# EAGLE schematic air_flow (EAGLE 9.5.2)
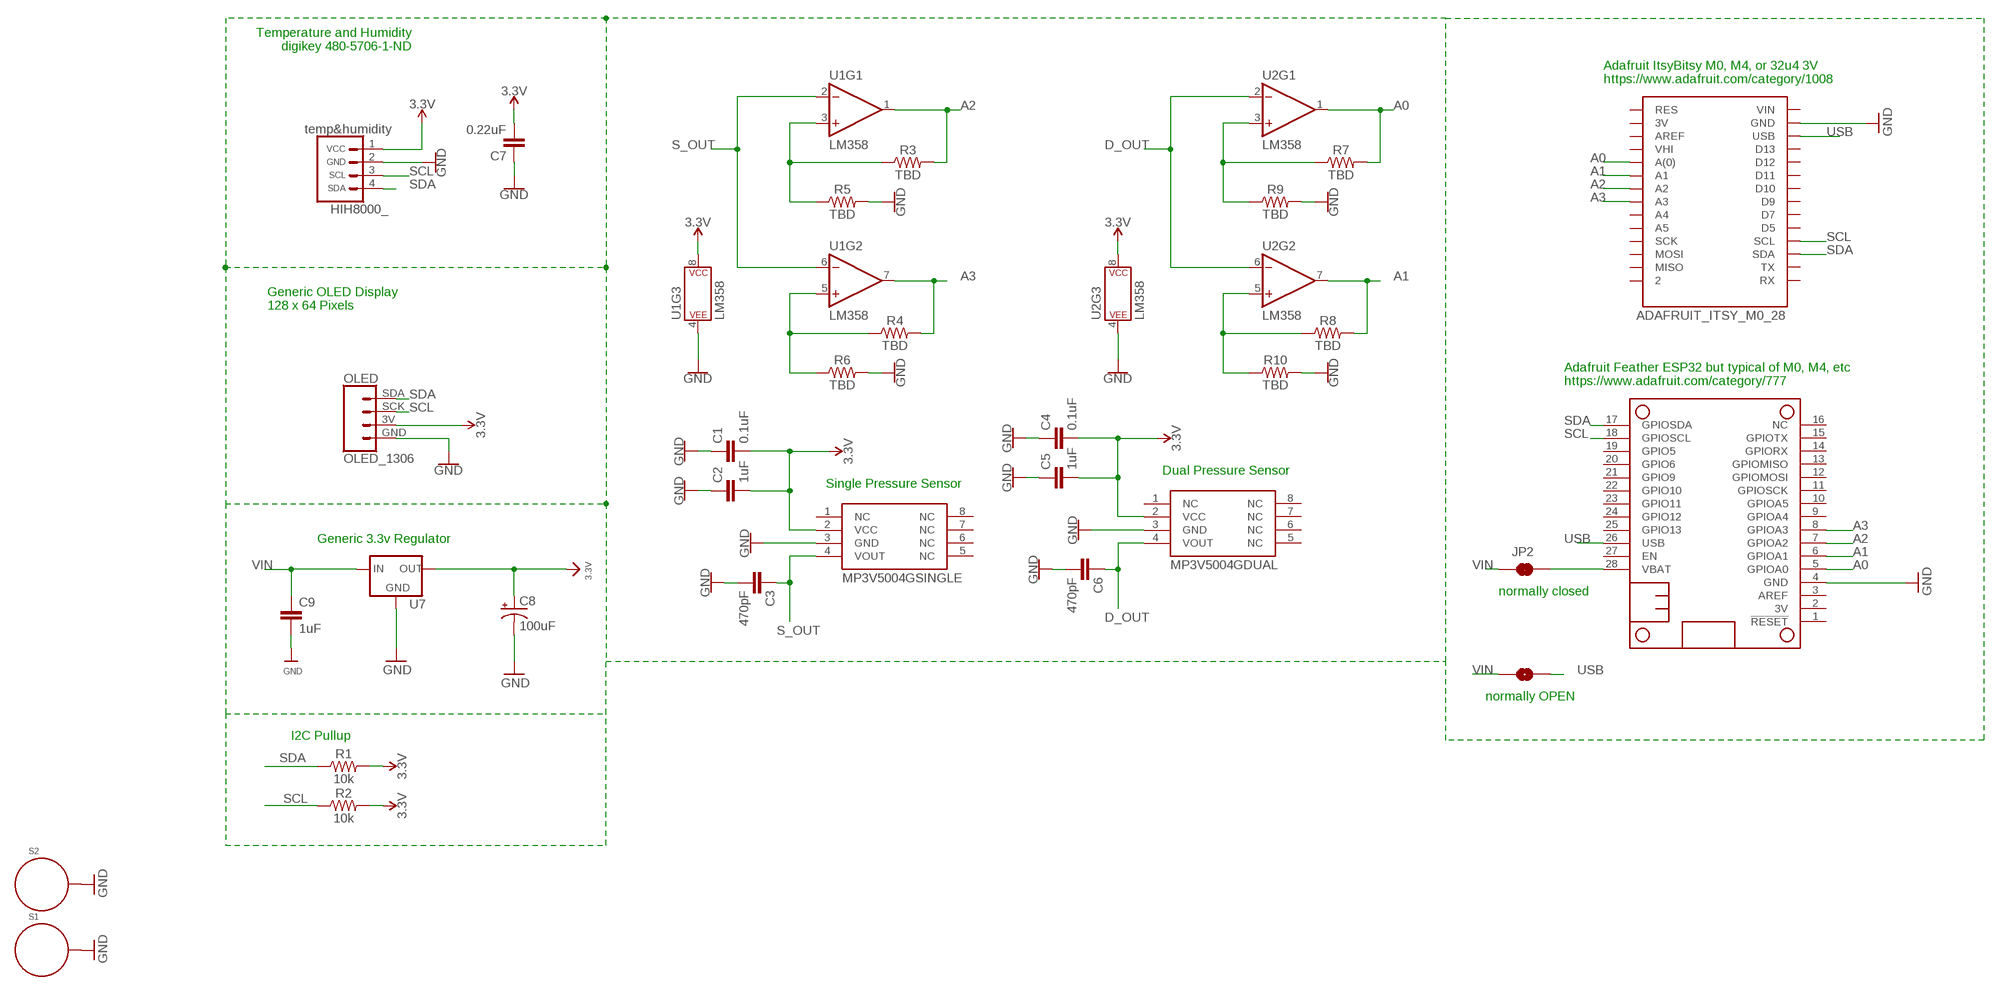
[diagram p0: schematic, sheet 1]

## Parts
C1  0.1uF  0.1UF-KIT-EZ-50V-20%  [CAP-PTH-SMALL-KIT]
C2  1uF  0.1UF-KIT-EZ-50V-20%  [CAP-PTH-SMALL-KIT]
C3  470pF  0.1UF-KIT-EZ-50V-20%  [CAP-PTH-SMALL-KIT]
C4  0.1uF  0.1UF-KIT-EZ-50V-20%  [CAP-PTH-SMALL-KIT]
C5  1uF  0.1UF-KIT-EZ-50V-20%  [CAP-PTH-SMALL-KIT]
C6  470pF  0.1UF-KIT-EZ-50V-20%  [CAP-PTH-SMALL-KIT]
C7  0.22uF  0.1UF-KIT-EZ-50V-20%  [CAP-PTH-SMALL-KIT]
C8  100uF  CPOL-USE3.5-8  [E3,5-8]
C9  1uF  0.1UF-KIT-EZ-50V-20%  [CAP-PTH-SMALL-KIT]
JP1  JUMPER-SMT_2_NO_NO-SILK  [SMT-JUMPER_2_NO_NO-SILK]
JP2  JUMPER-SMT_2_NC_TRACE_SILK  [SMT-JUMPER_2_NC_TRACE_SILK]
MS2  FEATHERWING_NODIM  [FEATHERWING_DIM]
R1  10k  10KOHM-HORIZ-1/4W-5%  [AXIAL-0.3]
R2  10k  10KOHM-HORIZ-1/4W-5%  [AXIAL-0.3]
R3  TBD  10KOHM-HORIZ-1/4W-5%  [AXIAL-0.3]
R4  TBD  10KOHM-HORIZ-1/4W-5%  [AXIAL-0.3]
R5  TBD  10KOHM-HORIZ-1/4W-5%  [AXIAL-0.3]
R6  TBD  10KOHM-HORIZ-1/4W-5%  [AXIAL-0.3]
R7  TBD  10KOHM-HORIZ-1/4W-5%  [AXIAL-0.3]
R8  TBD  10KOHM-HORIZ-1/4W-5%  [AXIAL-0.3]
R9  TBD  10KOHM-HORIZ-1/4W-5%  [AXIAL-0.3]
R10  TBD  10KOHM-HORIZ-1/4W-5%  [AXIAL-0.3]
S1  STANDOFF_ELECTRICAL5-32  [STANDOFF_ELECTRICAL_5_32]
S2  STANDOFF_ELECTRICAL5-32  [STANDOFF_ELECTRICAL_5_32]
U1  LM358  [DIP08]
U2  LM358  [DIP08]
U7  V_REG_78XXSINK  [TO220-IGO]
U$1  OLED_1306  [OLED_1306]
U$2  MP3V5004GSINGLE  [MP3V5004GP]
U$3  MP3V5004GDUAL  [MP3V5004DP]
U$4  HIH8000_  [HIH8120_TH]
U$45  ADAFRUIT_ITSY_M0_28  [ADAFRUIT_ITS_MO_28]

## Nets
3.3V: C1.2 C2.2 C4.2 C5.2 C7.2 C8.+ R1.P$2 R2.P$2 U1.8(P$V+) U2.8(P$V+) U7.OUT U$1.3V(VCC) U$2.2(VCC) U$3.2(VCC) U$4.1(VCC)
A0: MS2.5(GPIOA0) R7.P$2 U2.1(OUT) U$45.A0(A(0))
A1: MS2.6(GPIOA1) R8.P$2 U2.7(OUT) U$45.A1
A2: MS2.7(GPIOA2) R3.P$2 U1.1(OUT) U$45.A2
A3: MS2.8(GPIOA3) R4.P$2 U1.7(OUT) U$45.A3
D_OUT: C6.1 U2.2(-IN) U2.6(-IN) U$3.4(VOUT)
GND: C1.1 C2.1 C3.2 C4.1 C5.1 C6.2 C7.1 C8.- C9.2 MS2.4(GND) R5.P$2 R6.P$2 R9.P$2 R10.P$2 S1.P1 S2.P1 U1.4(P$V-) U2.4(P$V-) U7.GND U$1.GND U$2.3(GND) U$3.3(GND) U$4.2(GND) U$45.GND
N$1: R3.P$1 R5.P$1 U1.3(+IN)
N$3: JP1.1
N$5: R4.P$1 R6.P$1 U1.5(+IN)
N$6: R7.P$1 R9.P$1 U2.3(+IN)
N$8: R8.P$1 R10.P$1 U2.5(+IN)
S_OUT: C3.1 U1.2(-IN) U1.6(-IN) U$2.4(VOUT)
SCL: MS2.18(GPIOSCL) R2.P$1 U$1.SCK U$4.3(SCL) U$45.SCL
SDA: MS2.17(GPIOSDA) R1.P$1 U$1.SDA U$4.4(SDA) U$45.SDA
USB: JP1.2 MS2.26(USB) U$45.USB
VBAT: JP2.2 MS2.28(VBAT)
VIN: C9.1 JP2.1 U7.IN
Unconnected: MS2.1(!RESET) MS2.2(3V) MS2.3(AREF) MS2.9(GPIOA4) MS2.10(GPIOA5) MS2.11(GPIOSCK) MS2.12(GPIOMOSI) MS2.13(GPIOMISO) MS2.14(GPIORX) MS2.15(GPIOTX) MS2.16(NC) MS2.19(GPIO5) MS2.20(GPIO6) MS2.21(GPIO9) MS2.22(GPIO10) MS2.23(GPIO11) MS2.24(GPIO12) MS2.25(GPIO13) MS2.27(EN) U$2.1(NC) U$2.5(NC) U$2.6(NC) U$2.7(NC) U$2.8(NC) U$3.1(NC) U$3.5(NC) U$3.6(NC) U$3.7(NC) U$3.8(NC) U$45.2 U$45.3V U$45.A4 U$45.A5 U$45.AREF U$45.D5 U$45.D7 U$45.D9 U$45.D10 U$45.D11 U$45.D12 U$45.D13 U$45.MISO U$45.MOSI U$45.RES U$45.RX U$45.SCK U$45.TX U$45.VHI U$45.VIN

## Notes on the sheet
- Temperature and Humidity
  digikey 480-5706-1-ND
- Adafruit ItsyBitsy M0, M4, or 32u4 3V
  https://www.adafruit.com/category/1008
- Generic OLED Display
  128 x 64 Pixels
- Adafruit Feather ESP32 but typical of M0, M4, etc
  https://www.adafruit.com/category/777
- Dual Pressure Sensor
- Single Pressure Sensor
- Generic 3.3v Regulator
- normally closed
- normally OPEN
- I2C Pullup

## Library data of the parts
C1 C4 = SparkFun-Capacitors:0.1UF: 0.1µF ceramic capacitors A capacitor is a passive two-terminal electrical component used to store electrical energy temporarily in an electric field.; PROD_ID: CAP-08370
C2 C3 C5-C7 C9 = SparkFun-Capacitors:0.1UF: 0.1µF ceramic capacitors A capacitor is a passive two-terminal electrical component used to store electrical energy temporarily in an electric field.; PROD_ID: CAP-08370; VALUE: 0.1uF
C8 = rcl:CPOL-US: POLARIZED CAPACITOR, American symbol; SPICEPREFIX: C
JP1 = SparkFun-Jumpers:JUMPER-SMT_2_NO: Normally open jumper This jumper has two pads in close proximity to each other. Apply solder to close the connection. Round pads are easier to solder for beginners, but are a lot larger. SparkFun Product that uses the round pads: SparkFun EL Sequencer <https://www.sparkfun.com/products/12781>
JP2 = SparkFun-Jumpers:JUMPER-SMT_2_NC_TRACE: Normally closed trace jumper This jumper has a trace between two pads so it's normally closed (NC). Use a razor knife to open the connection. For best results follow the IPC guidelines for cutting traces: Cutout at least 0.063 mm (0.005 in). Remove all loose material to clean up the cut area. Seal the cut with an approved epoxy. Reapply solder to reclose the connection.
MS2 = th_libraries:FEATHERWING
R1 R2 = SparkFun-Resistors:10KOHM: 10kΩ resistor A resistor is a passive two-terminal electrical component that implements electrical resistance as a circuit element. Resistors act to reduce current flow, and, at the same time, act to lower voltage levels within circuits. - Wikipedia; PROD_ID: RES-09435
R3-R10 = SparkFun-Resistors:10KOHM: 10kΩ resistor A resistor is a passive two-terminal electrical component that implements electrical resistance as a circuit element. Resistors act to reduce current flow, and, at the same time, act to lower voltage levels within circuits. - Wikipedia; PROD_ID: RES-09435; VALUE: 10k
S1 S2 = th_libraries:STANDOFF_ELECTRICAL: A standoff intended to be an electrically connected point. Pad size and stop size allow for a #8 Phillips pan screw head to make a solid connection to the board. Added 144mill drill hole that fits my normal wood screw
U1 U2 = SparkFun-IC-Amplifiers:LM358: LM358 Jellybean op-amp Datasheet <http://www.sparkfun.com/datasheets/Components/General/LM358.pdf> SparkFun Products Op-Amp (Thru-Hole) - LM358 <https://www.sparkfun.com/products/9456> (COM-09456); PROD_ID: IC-09172
U7 = SparkFun-IC-Power:V_REG_78XX: Voltage Regulator Standard 78xx regulator. IGO (Input Ground Output). Spark Fun Electronics SKU : COM-00107
U$1 = air_flow:OLED_1306
U$2 U$3 = air_flow_2:MP3V5004G: https://www.nxp.com/docs/en/data-sheet/MP3V5004G.pdf
U$4 = air_flow_2:HIH8000_: https://sensing.honeywell.com/index.php?ci_id=147072 https://www.digikey.com/product-detail/en/HIH8120-021-001/480-5706-1-ND
U$45 = easy_bee_counter:ADAFRUIT_ITSY_M0_28